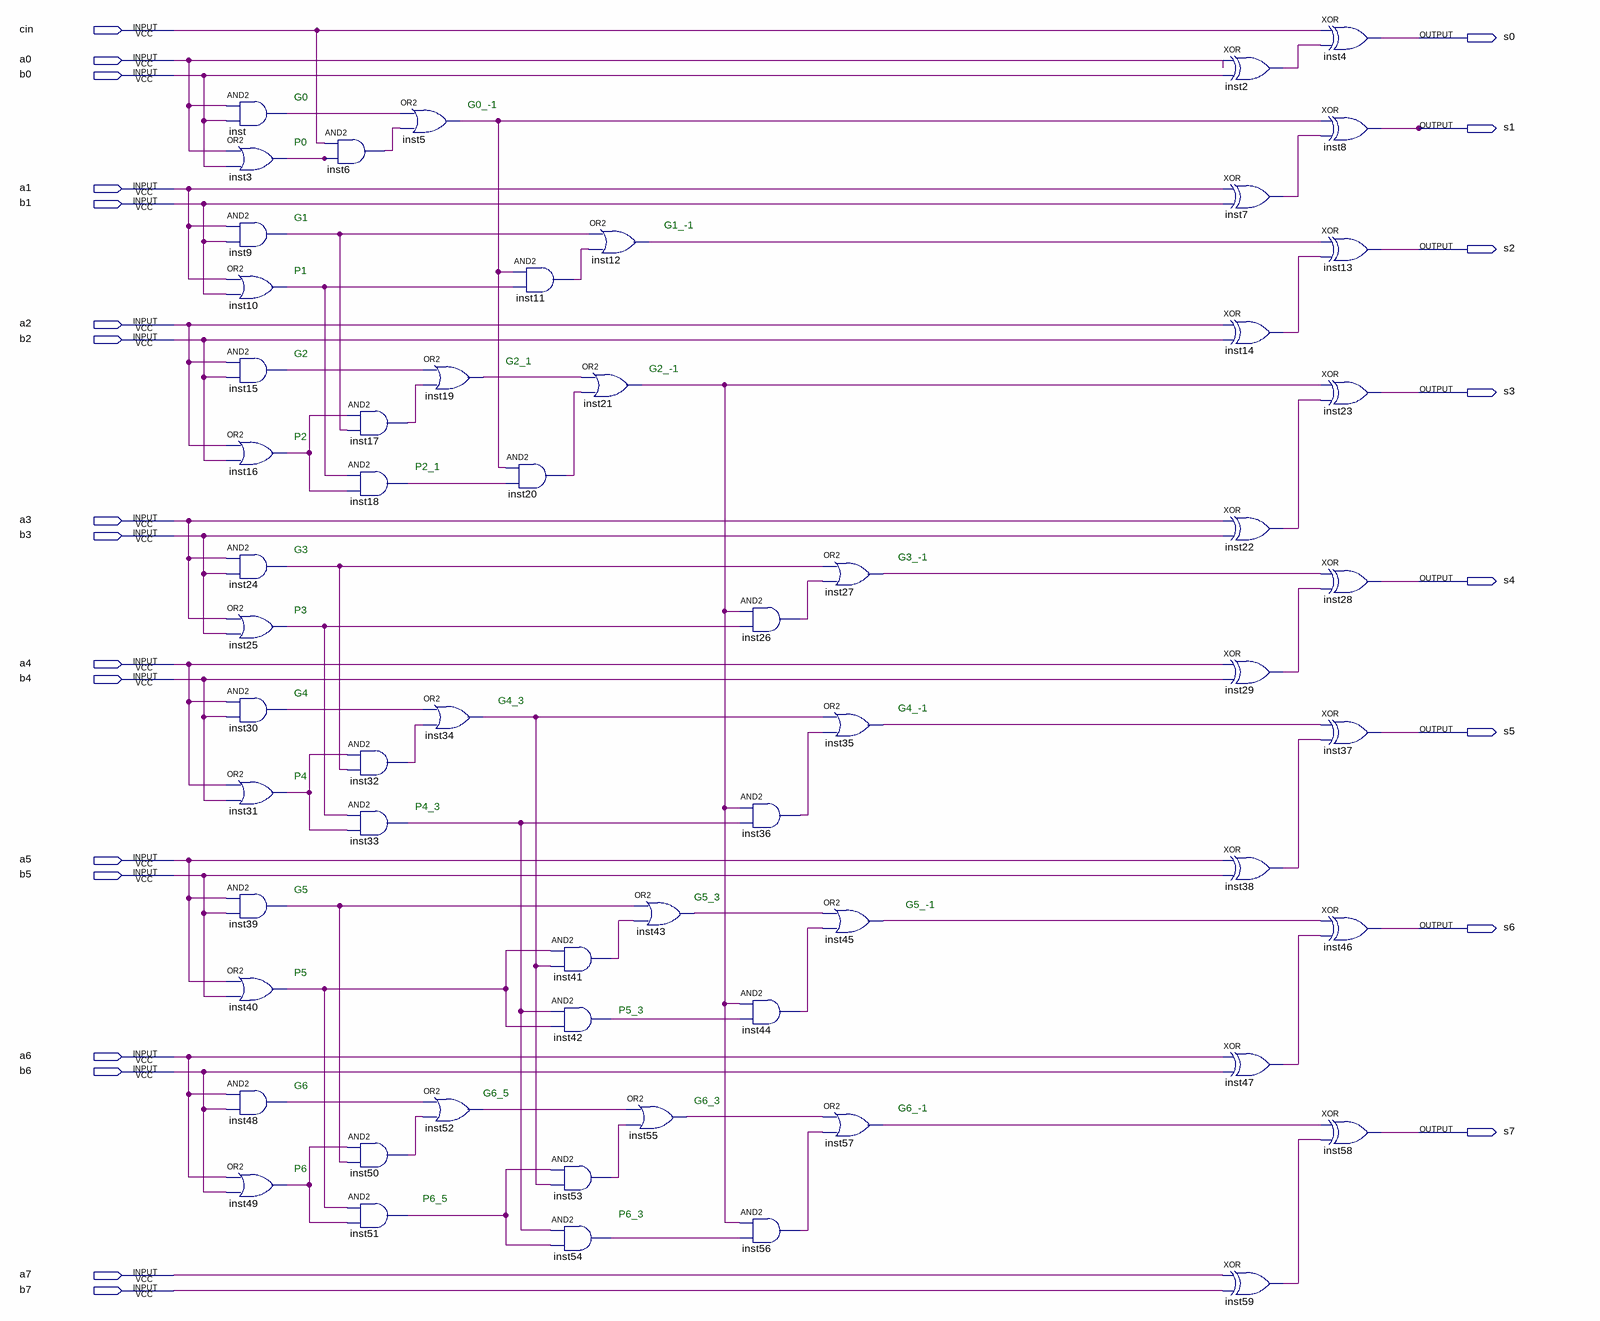
[diagram p0: schematic sheet]
// Quartus schematic prefixadder8bits.bdf as structural Verilog: 59 symbols, 25 pins
module prefixadder8bits (
  input  cin,
  input  a0,
  input  b0,
  input  a1,
  input  b1,
  input  a2,
  input  b2,
  input  a3,
  input  b3,
  input  a4,
  input  b4,
  input  a5,
  input  b5,
  input  a6,
  input  b6,
  input  a7,
  input  b7,
  output s0,
  output s1,
  output s2,
  output s3,
  output s4,
  output s5,
  output s6,
  output s7
);

  wire inst2_out, inst3_out, inst5_out, inst6_out, inst7_out, inst9_out, inst10_out, inst11_out, inst12_out,
       inst14_out, inst15_out, inst16_out, inst17_out, inst18_out, inst19_out, inst20_out, inst21_out,
       inst22_out, inst24_out, inst25_out, inst26_out, inst27_out, inst29_out, inst30_out, inst31_out,
       inst32_out, inst33_out, inst34_out, inst35_out, inst36_out, inst38_out, inst39_out, inst40_out,
       inst41_out, inst42_out, inst43_out, inst44_out, inst45_out, inst47_out, inst48_out, inst49_out,
       inst50_out, inst51_out, inst52_out, inst53_out, inst54_out, inst55_out, inst56_out, inst57_out,
       inst59_out, inst_out;

  and inst (inst_out, a0, b0);
  or inst3 (inst3_out, a0, b0);
  and inst9 (inst9_out, a1, b1);
  or inst10 (inst10_out, a1, b1);
  and inst15 (inst15_out, a2, b2);
  or inst16 (inst16_out, a2, b2);
  and inst24 (inst24_out, a3, b3);
  or inst25 (inst25_out, a3, b3);
  and inst30 (inst30_out, a4, b4);
  or inst31 (inst31_out, a4, b4);
  and inst39 (inst39_out, a5, b5);
  or inst40 (inst40_out, a5, b5);
  and inst48 (inst48_out, a6, b6);
  or inst49 (inst49_out, a6, b6);
  and inst6 (inst6_out, cin, inst3_out);
  and inst17 (inst17_out, inst16_out, inst9_out);
  and inst18 (inst18_out, inst10_out, inst16_out);
  and inst32 (inst32_out, inst31_out, inst24_out);
  and inst33 (inst33_out, inst25_out, inst31_out);
  and inst50 (inst50_out, inst49_out, inst39_out);
  and inst51 (inst51_out, inst40_out, inst49_out);
  or inst5 (inst5_out, inst_out, inst6_out);
  or inst19 (inst19_out, inst15_out, inst17_out);
  or inst34 (inst34_out, inst30_out, inst32_out);
  or inst52 (inst52_out, inst48_out, inst50_out);
  and inst11 (inst11_out, inst5_out, inst10_out);
  and inst20 (inst20_out, inst5_out, inst18_out);
  and inst41 (inst41_out, inst40_out, inst34_out);
  and inst42 (inst42_out, inst33_out, inst40_out);
  and inst53 (inst53_out, inst51_out, inst34_out);
  and inst54 (inst54_out, inst33_out, inst51_out);
  or inst12 (inst12_out, inst9_out, inst11_out);
  or inst21 (inst21_out, inst19_out, inst20_out);
  or inst43 (inst43_out, inst39_out, inst41_out);
  or inst55 (inst55_out, inst52_out, inst53_out);
  and inst26 (inst26_out, inst21_out, inst25_out);
  and inst36 (inst36_out, inst21_out, inst33_out);
  and inst44 (inst44_out, inst21_out, inst42_out);
  and inst56 (inst56_out, inst21_out, inst54_out);
  or inst27 (inst27_out, inst24_out, inst26_out);
  or inst35 (inst35_out, inst34_out, inst36_out);
  or inst45 (inst45_out, inst43_out, inst44_out);
  or inst57 (inst57_out, inst55_out, inst56_out);
  xor inst2 (inst2_out, a0, b0);
  xor inst7 (inst7_out, a1, b1);
  xor inst14 (inst14_out, a2, b2);
  xor inst22 (inst22_out, a3, b3);
  xor inst29 (inst29_out, a4, b4);
  xor inst38 (inst38_out, a5, b5);
  xor inst47 (inst47_out, a6, b6);
  xor inst59 (inst59_out, a7, b7);
  xor inst4 (s0, cin, inst2_out);
  xor inst8 (s1, inst5_out, inst7_out);
  xor inst13 (s2, inst12_out, inst14_out);
  xor inst23 (s3, inst21_out, inst22_out);
  xor inst28 (s4, inst27_out, inst29_out);
  xor inst37 (s5, inst35_out, inst38_out);
  xor inst46 (s6, inst45_out, inst47_out);
  xor inst58 (s7, inst57_out, inst59_out);

  // Notes on the sheet:
  //   G0
  //   G0_-1
  //   P0
  //   G1
  //   G1_-1
  //   P1
  //   G2
  //   G2_1
  //   G2_-1
  //   P2
  //   P2_1
  //   G3
  //   G3_-1
  //   P3
  //   G4
  //   G4_3
  //   G4_-1
  //   P4
  //   P4_3
  //   G5
  //   G5_3
  //   G5_-1
  //   P5
  //   P5_3
  //   G6
  //   G6_5
  //   G6_3
  //   G6_-1
  //   P6
  //   P6_5
  //   P6_3
endmodule
